# EAGLE design vstupyPCF8574 (EAGLE 9.1.3)
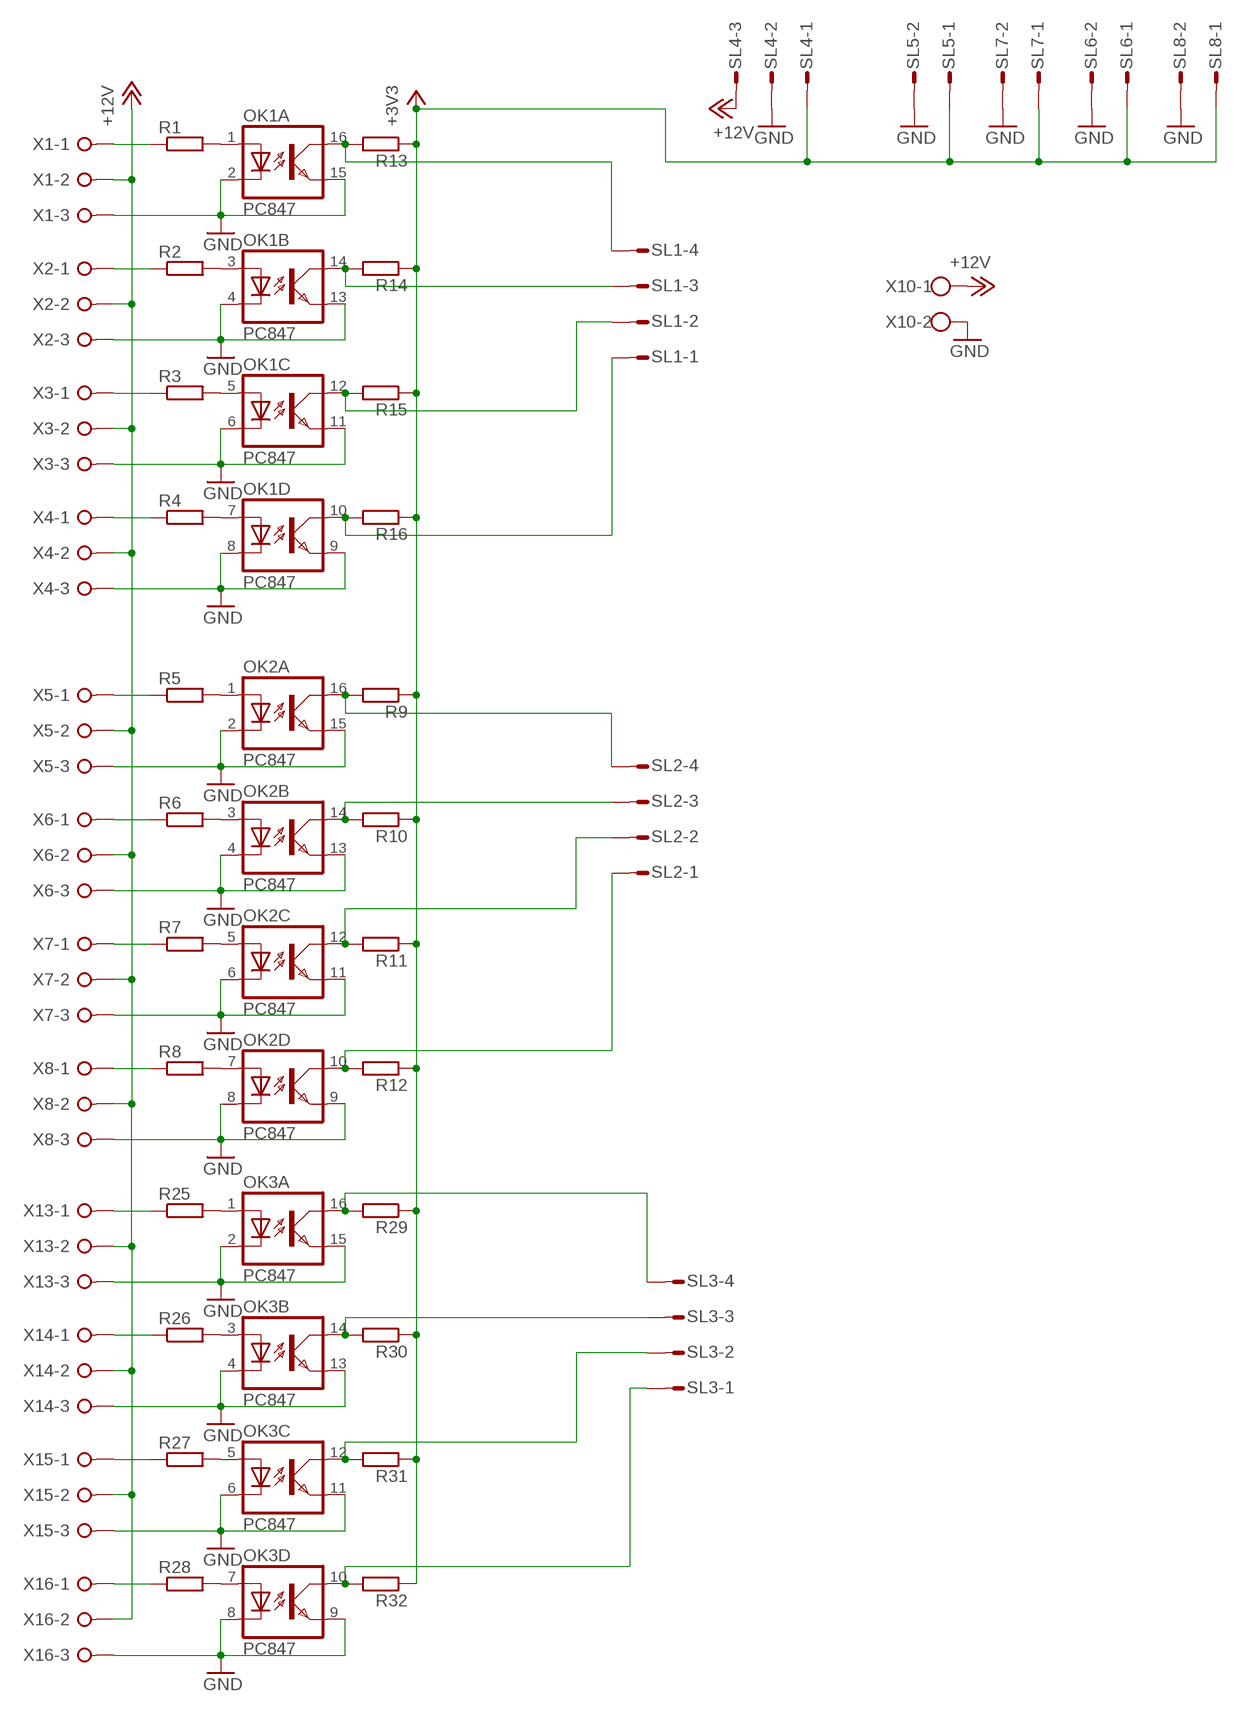
[diagram p0: schematic, sheet 1]

## Parts
OK1  PC847  [DIL16]
OK2  PC847  [DIL16]
OK3  PC847  [DIL16]
R1  R-EU_0204/5  [0204/5]
R2  R-EU_0204/5  [0204/5]
R3  R-EU_0204/5  [0204/5]
R4  R-EU_0204/5  [0204/5]
R5  R-EU_0204/5  [0204/5]
R6  R-EU_0204/5  [0204/5]
R7  R-EU_0204/5  [0204/5]
R8  R-EU_0204/5  [0204/5]
R9  R-EU_0204/5  [0204/5]
R10  R-EU_0204/5  [0204/5]
R11  R-EU_0204/5  [0204/5]
R12  R-EU_0204/5  [0204/5]
R13  R-EU_0204/5  [0204/5]
R14  R-EU_0204/5  [0204/5]
R15  R-EU_0204/5  [0204/5]
R16  R-EU_0204/5  [0204/5]
R25  R-EU_0204/5  [0204/5]
R26  R-EU_0204/5  [0204/5]
R27  R-EU_0204/5  [0204/5]
R28  R-EU_0204/5  [0204/5]
R29  R-EU_0204/5  [0204/5]
R30  R-EU_0204/5  [0204/5]
R31  R-EU_0204/5  [0204/5]
R32  R-EU_0204/5  [0204/5]
SL1  M04S  [04P]
SL2  M04S  [04P]
SL3  M04S  [04P]
SL4  M03S  [03P]
SL5  M02S  [02P]
SL6  M02S  [02P]
SL7  M02S  [02P]
SL8  M02S  [02P]
X1  W237-3E  [W237-3E]
X2  W237-3E  [W237-3E]
X3  W237-3E  [W237-3E]
X4  W237-3E  [W237-3E]
X5  W237-3E  [W237-3E]
X6  W237-3E  [W237-3E]
X7  W237-3E  [W237-3E]
X8  W237-3E  [W237-3E]
X10  W237-102  [W237-102]
X13  W237-3E  [W237-3E]
X14  W237-3E  [W237-3E]
X15  W237-3E  [W237-3E]
X16  W237-3E  [W237-3E]

## Nets
+3V3: R9.1 R10.1 R11.1 R12.1 R13.1 R14.1 R15.1 R16.1 R29.1 R30.1 R31.1 R32.1 SL4.1 SL5.1 SL6.1 SL7.1 SL8.1
+12V: SL4.3 X1.2 X2.2 X3.2 X4.2 X5.2 X6.2 X7.2 X8.2 X10.1 X13.2 X14.2 X15.2 X16.2
GND: OK1.2(A:C) OK1.4(B:C) OK1.6(C:C) OK1.8(D:C) OK1.9(D:EMIT) OK1.11(C:EMIT) OK1.13(B:EMIT) OK1.15(A:EMIT) OK2.2(A:C) OK2.4(B:C) OK2.6(C:C) OK2.8(D:C) OK2.9(D:EMIT) OK2.11(C:EMIT) OK2.13(B:EMIT) OK2.15(A:EMIT) OK3.2(A:C) OK3.4(B:C) OK3.6(C:C) OK3.8(D:C) OK3.9(D:EMIT) OK3.11(C:EMIT) OK3.13(B:EMIT) OK3.15(A:EMIT) SL4.2 SL5.2 SL6.2 SL7.2 SL8.2 X1.3 X2.3 X3.3 X4.3 X5.3 X6.3 X7.3 X8.3 X10.2 X13.3 X14.3 X15.3 X16.3
N$1: OK1.1(A:A) R1.2
N$2: OK1.3(B:A) R2.2
N$3: OK1.5(C:A) R3.2
N$4: OK1.7(D:A) R4.2
N$5: OK2.1(A:A) R5.2
N$6: OK2.3(B:A) R6.2
N$7: OK2.5(C:A) R7.2
N$8: OK2.7(D:A) R8.2
N$9: R5.1 X5.1
N$10: R6.1 X6.1
N$11: R7.1 X7.1
N$12: R8.1 X8.1
N$13: R1.1 X1.1
N$14: R2.1 X2.1
N$15: R3.1 X3.1
N$16: R4.1 X4.1
N$17: OK2.16(A:COL) R9.2 SL2.4
N$18: OK2.14(B:COL) R10.2 SL2.3
N$19: OK2.12(C:COL) R11.2 SL2.2
N$20: OK2.10(D:COL) R12.2 SL2.1
N$21: OK1.16(A:COL) R13.2 SL1.4
N$22: OK1.14(B:COL) R14.2 SL1.3
N$23: OK1.12(C:COL) R15.2 SL1.2
N$24: OK3.16(A:COL) R29.2 SL3.4
N$25: OK3.14(B:COL) R30.2 SL3.3
N$26: OK3.12(C:COL) R31.2 SL3.2
N$27: OK3.10(D:COL) R32.2 SL3.1
N$35: OK1.10(D:COL) R16.2 SL1.1
N$37: OK3.1(A:A) R25.2
N$38: OK3.3(B:A) R26.2
N$39: OK3.5(C:A) R27.2
N$40: OK3.7(D:A) R28.2
N$41: R25.1 X13.1
N$42: R26.1 X14.1
N$43: R27.1 X15.1
N$44: R28.1 X16.1

## Library data of the parts
OK1-OK3 = optocoupler:PC847: SHARP OPTO COUPLER; OC_FARNELL: 9707735; OC_NEWARK: unknown
R1-R16 R25-R32 = resistor:R-EU_: RESISTOR, European symbol
SL1-SL3 = con-amp-quick:M04S: AMP QUICK CONNECTOR; OC_FARNELL: unknown; OC_NEWARK: unknown
SL4 = con-amp-quick:M03S: AMP QUICK CONNECTOR; OC_FARNELL: unknown; OC_NEWARK: unknown
SL5-SL8 = con-amp-quick:M02S: AMP QUICK CONNECTOR; OC_FARNELL: unknown; OC_NEWARK: unknown
X1-X8 X13-X16 = con-wago-508:W237-3E: WAGO SREW CLAMP; OC_FARNELL: unknown; OC_NEWARK: unknown
X10 = con-wago-500:W237-102: WAGO SCREW CLAMP; MPN: 237-102; OC_FARNELL: unknown; OC_NEWARK: 70K9898

## Board
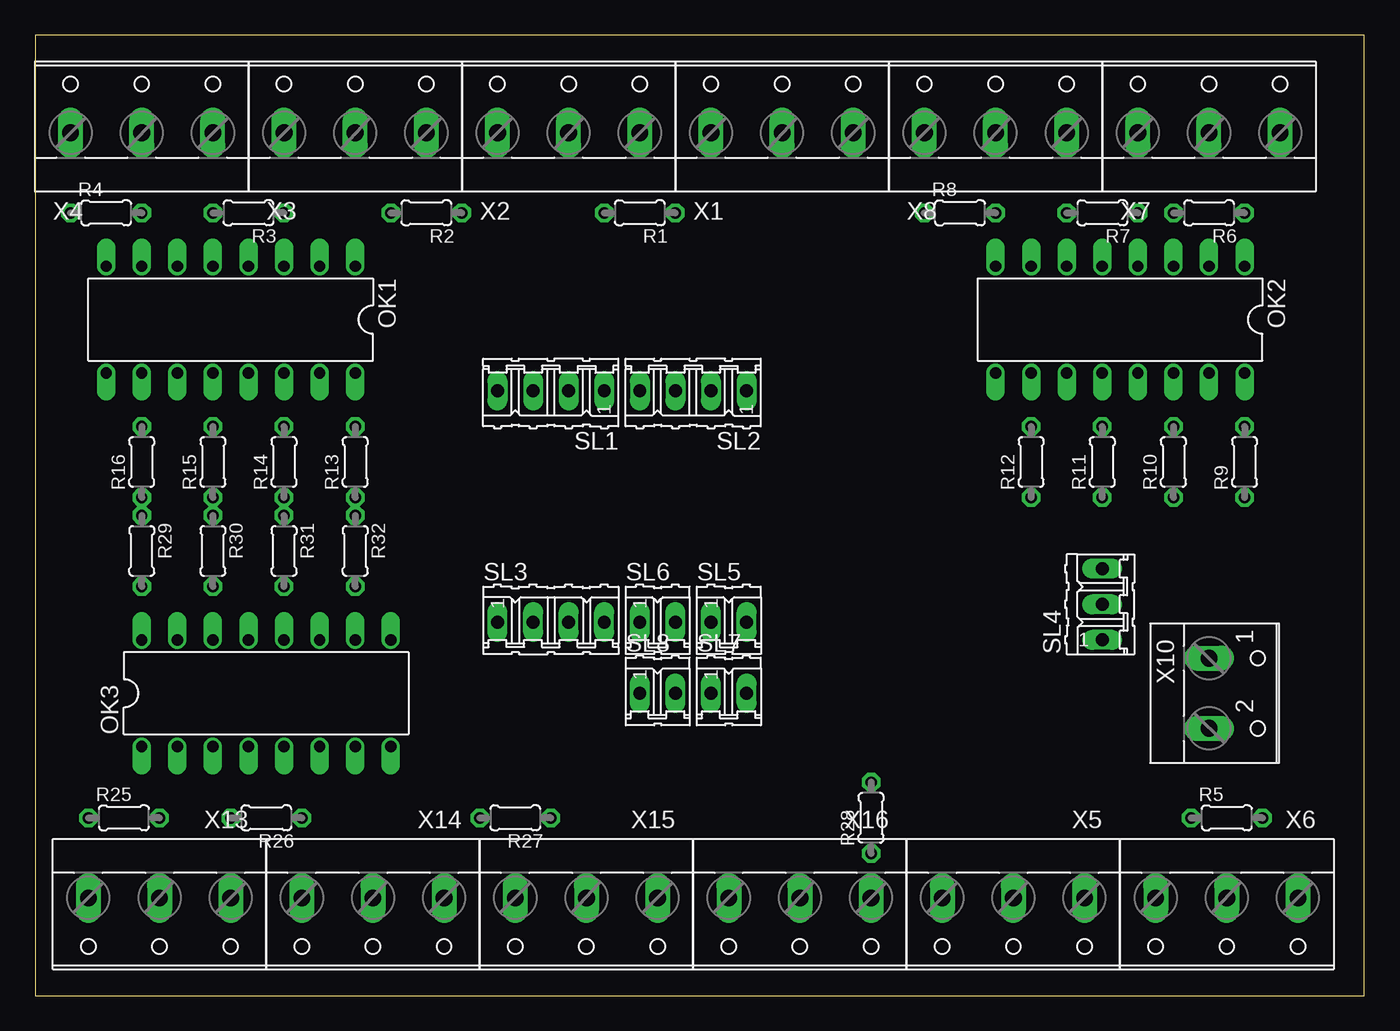
[diagram p1: board, top side]
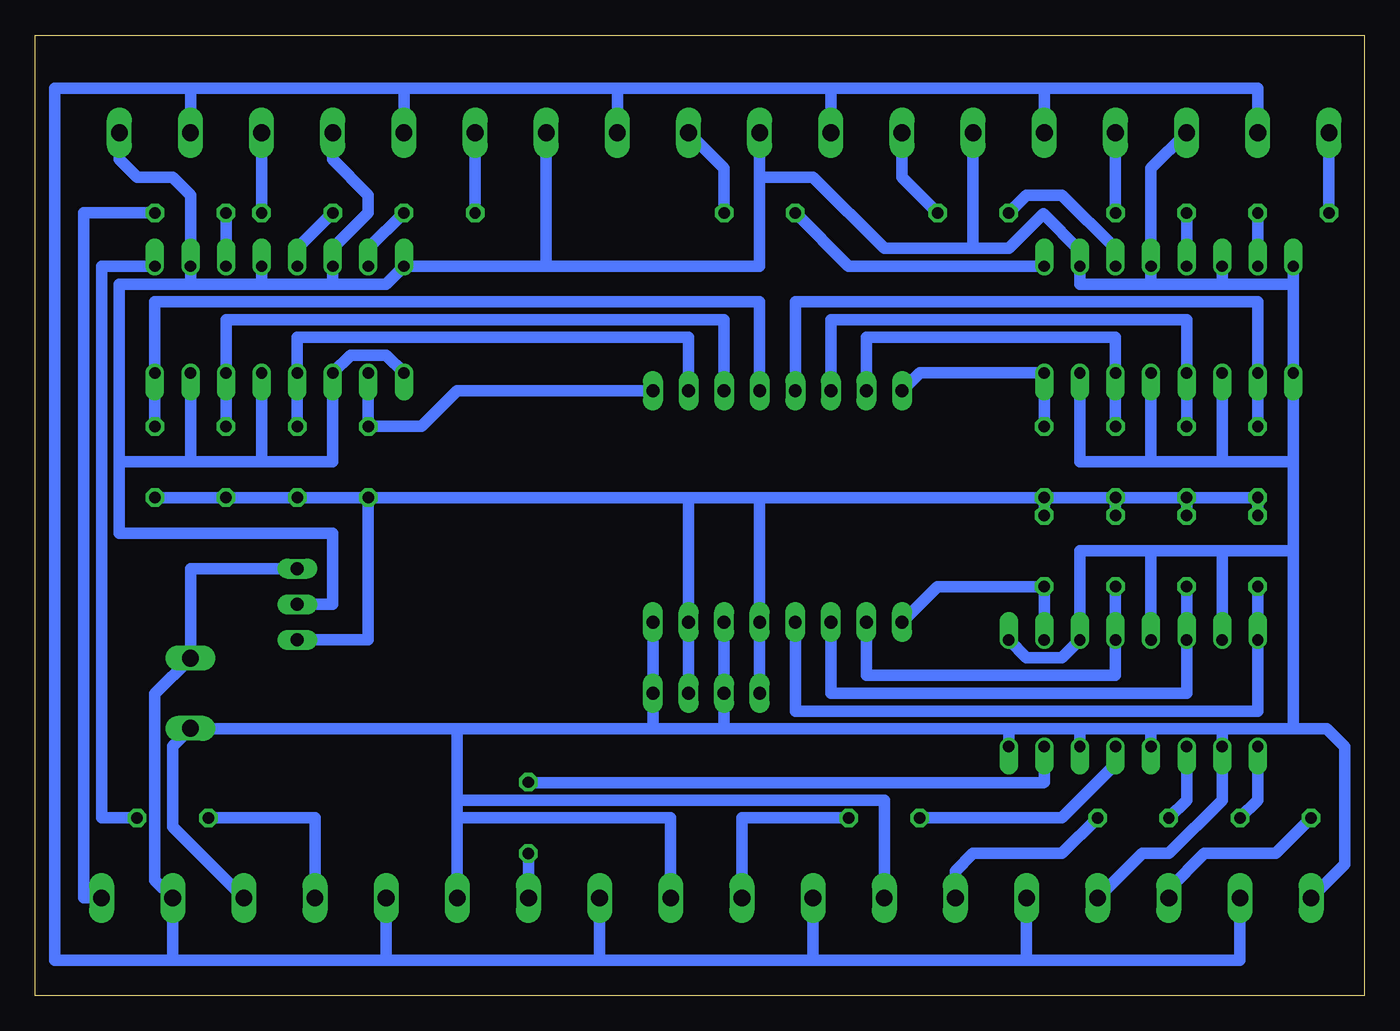
[diagram p2: board, bottom side, seen from below]

Size 94.92 x 68.57 mm. Coordinates in mm from the lower left corner, seen from the top.
Outline: 0,0 94.92,0 94.92,68.57 0,68.57 0,0
Copper layers (1*16): Top 0.035mm / dielectric 1.5mm / Bottom 0.035mm
Design rules "default": minimum track width 10mil, minimum drill 24mil, track to track 8mil, track to pad 8mil, pad to pad 8mil, via to via 8mil, smd to smd 8mil, copper to edge 40mil, drill to drill 8mil, minimum pad ring 10mil, minimum via ring 8mil, stop-mask expansion 4mil, vias tented up to drill 0mil, thermal gap 10mil

### Footprints (pad centres in the part's own frame; a part is rotated, then mirrored left to right if it is on the bottom)
DIL16 = drill 0.813 offset: 1 -8.89,-3.81; 2 -6.35,-3.81; 3 -3.81,-3.81; 4 -1.27,-3.81; 5 1.27,-3.81; 6 3.81,-3.81; 7 6.35,-3.81; 8 8.89,-3.81; 9 8.89,3.81; 10 6.35,3.81; 11 3.81,3.81; 12 1.27,3.81; 13 -1.27,3.81; 14 -3.81,3.81; 15 -6.35,3.81; 16 -8.89,3.81
0204/5 = drill 0.813 octagon: 1 -2.54,0; 2 2.54,0
04P = drill 0.914 long: 1 -3.81,0; 2 -1.27,0; 3 1.27,0; 4 3.81,0
03P = drill 0.914 long: 1 -2.54,0; 2 0,0; 3 2.54,0
02P = drill 0.914 long: 1 -1.27,0; 2 1.27,0
W237-3E = drill 1.194 long: 1 -5.08,-0.635; 2 0,-0.635; 3 5.08,-0.635
W237-102 = drill 1.194 long: 1 -2.5,-1.27; 2 2.5,-1.27

### Placement (x,y rotation side)
OK1  13.97,48.26 180 top
OK2  77.47,48.26 180 top
OK3  16.51,21.59 0 top
R1  43.18,55.88 180 top
R2  27.94,55.88 180 top
R3  15.24,55.88 180 top
R4  5.08,55.88 0 top
R5  85.09,12.7 0 top
R6  83.82,55.88 180 top
R7  76.2,55.88 180 top
R8  66.04,55.88 0 top
R9  86.36,38.1 90 top
R10  81.28,38.1 90 top
R11  76.2,38.1 90 top
R12  71.12,38.1 90 top
R13  22.86,38.1 90 top
R14  17.78,38.1 90 top
R15  12.7,38.1 90 top
R16  7.62,38.1 90 top
R25  6.35,12.7 0 top
R26  16.51,12.7 180 top
R27  34.29,12.7 180 top
R28  59.69,12.7 90 top
R29  7.62,31.75 270 top
R30  12.7,31.75 270 top
R31  17.78,31.75 270 top
R32  22.86,31.75 270 top
SL1  36.83,43.18 180 top
SL2  46.99,43.18 180 top
SL3  36.83,26.67 0 top
SL4  76.2,27.94 90 top
SL5  49.53,26.67 0 top
SL6  44.45,26.67 0 top
SL7  49.53,21.59 0 top
SL8  44.45,21.59 0 top
X1  53.34,62.23 0 top
X2  38.1,62.23 0 top
X3  22.86,62.23 0 top
X4  7.62,62.23 0 top
X5  69.85,6.35 180 top
X6  85.09,6.35 180 top
X7  83.82,62.23 0 top
X8  68.58,62.23 0 top
X10  85.09,21.59 270 top
X13  8.89,6.35 180 top
X14  24.13,6.35 180 top
X15  39.37,6.35 180 top
X16  54.61,6.35 180 top

### Tracks (layer width: path | path; a pad name or v marks a point on that pad's centre or on a via)
+3V3
  Bottom 0.813: R15.1 R16.1 R29.1 | R15.1 R14.1 | R14.1 R13.1 | R30.1 R15.1 | R31.1 R14.1 | R32.1 R13.1 | R12.1 R11.1 R10.1 R9.1 | 48.26,35.56 R12.1 | SL4.1 71.12,25.4 R12.1 | R13.1 43.18,35.56 | 43.18,35.56 48.26,35.56 | 48.26,35.56 SL5.1 SL7.1 | 43.18,35.56 SL6.1 SL8.1
+12V
  Bottom 0.813: X4.2 7.62,64.77 22.86,64.77 | X3.2 22.86,64.77 | X2.2 38.1,64.77 | 38.1,64.77 22.86,64.77 | X1.2 53.34,64.77 | 53.34,64.77 38.1,64.77 | X8.2 68.58,64.77 | 68.58,64.77 53.34,64.77 | 83.82,64.77 68.58,64.77 | X13.2 8.89,2.54 24.13,2.54 | 24.13,2.54 X14.2 | 24.13,2.54 39.37,2.54 | 39.37,2.54 X15.2 | 39.37,2.54 54.61,2.54 | 54.61,2.54 X16.2 | 69.85,2.54 X5.2 | 54.61,2.54 69.85,2.54 | 85.09,2.54 69.85,2.54 | X7.2 83.82,64.77 | 85.09,2.54 X6.2 86.36,8.26 86.36,21.55 X10.1 83.82,30.48 SL4.3 | 85.09,2.54 93.5,2.54 93.5,64.77 83.82,64.77
GND
  Bottom 0.813: 5.08,50.8 OK1.9 5.08,38.1 | 5.08,50.8 OK1.8 | X4.3 15.24,59.05 OK1.4 15.24,50.8 | 27.94,53.34 X3.3 | 27.94,53.34 34.29,53.34 39.37,58.42 43.18,58.42 X2.3 43.18,52.07 58.42,52.07 | 58.42,52.07 X1.3 | 58.42,52.07 OK2.8 69.85,50.8 73.66,50.8 | X8.3 73.66,59.69 71.12,57.15 71.12,55.88 73.66,53.34 OK2.6 73.66,50.8 | X7.3 88.9,59.69 87.63,58.42 85.09,58.42 83.82,57.15 OK2.2 83.82,50.8 | 27.94,53.34 25.4,53.34 22.94,55.8 20.32,53.17 OK1.2 20.32,50.8 15.24,50.8 | 5.08,50.8 10.16,50.8 | OK1.6 10.16,50.8 | 10.16,50.8 15.24,50.8 | 73.66,50.8 78.74,50.8 | 78.74,50.8 83.82,50.8 | OK2.4 78.74,50.8 | 10.16,19.05 OK3.2 10.16,13.97 13.97,10.16 15.88,10.16 X14.3 | 10.16,19.05 15.24,19.05 | 15.24,19.05 20.32,19.05 | 20.32,19.05 25.4,19.05 | 25.4,19.05 OK3.8 | OK3.4 15.24,19.05 | OK3.6 20.32,19.05 | X13.3 1.42,9.37 1.42,17.78 2.69,19.05 5.08,19.05 | 5.08,19.05 10.16,19.05 | X5.3 64.77,12.7 | 64.77,12.7 64.77,13.97 | 64.77,13.97 64.77,19.05 | 5.08,38.1 10.16,38.1 | 10.16,38.1 OK1.11 | 10.16,38.1 15.24,38.1 | 15.24,38.1 OK1.13 | 15.24,38.1 20.32,38.1 OK1.15 | OK3.13 15.24,31.75 | 15.24,31.75 20.32,31.75 OK3.11 21.59,24.13 24.13,24.13 OK3.9 | OK3.15 10.16,31.75 | 10.16,31.75 15.24,31.75 | OK2.15 83.82,38.1 | 83.82,38.1 78.74,38.1 | 78.74,38.1 OK2.13 | 78.74,38.1 73.66,38.1 OK2.11 72.39,45.72 69.85,45.72 OK2.9 | 83.82,38.1 88.9,38.1 | 5.08,38.1 5.08,31.75 | 5.08,31.75 10.16,31.75 | 5.08,31.75 5.08,19.05 | X16.3 49.53,12.7 64.77,12.7 | 50.8,19.05 64.77,19.05 | X15.3 34.29,13.97 64.77,13.97 | 83.82,50.8 88.9,50.8 88.9,38.1 | 64.77,19.05 82.47,19.05 82.51,19.09 X10.2 85.09,17.82 85.09,12.06 X6.3 | 25.4,19.05 45.72,19.05 | 45.72,19.05 50.8,19.05 | SL4.2 73.66,27.94 73.66,33.02 88.9,33.02 88.9,38.1
  Bottom 0.813: SL5.2 SL7.2 50.8,19.05 | SL6.2 SL8.2 45.72,19.05
N$1
  Bottom 0.813: R1.2 36.83,52.07 OK1.1
N$2
  Bottom 0.813: OK1.3 17.78,53.34 21.59,57.15 24.13,57.15 R2.2
N$3
  Bottom 0.813: R3.2 OK1.5
N$4
  Bottom 0.813: R4.2 OK1.7
N$5
  Bottom 0.813: R5.2 90.17,12.7 90.17,52.07 OK2.1
N$6
  Bottom 0.813: R6.2 OK2.3
N$7
  Bottom 0.813: R7.2 76.2,53.34 OK2.5
N$8
  Bottom 0.813: R8.2 71.12,53.34 OK2.7
N$9
  Bottom 0.813: X5.1 74.93,12.7 R5.1
N$10
  Bottom 0.813: R6.1 91.44,55.88 91.44,6.99 X6.1
N$11
  Bottom 0.813: X7.1 R7.1
N$12
  Bottom 0.813: X8.1 R8.1
N$13
  Bottom 0.813: R1.1 45.72,59.05 X1.1
N$14
  Bottom 0.813: X2.1 33.02,60.32 33.02,58.42 R2.1
N$15
  Bottom 0.813: X3.1 R3.1
N$16
  Bottom 0.813: X4.1 R4.1
N$17
  Bottom 0.813: R9.2 OK2.16 86.36,49.53 43.18,49.53 SL2.4
N$18
  Bottom 0.813: R10.2 OK2.14 81.28,48.26 45.72,48.26 SL2.3
N$19
  Bottom 0.813: R11.2 OK2.12 76.2,46.99 48.26,46.99 SL2.2
N$20
  Bottom 0.813: OK2.10 R12.2 67.31,40.64 64.77,43.18 SL2.1
N$21
  Bottom 0.813: R13.2 OK1.16 31.75,44.45 SL1.4
N$22
  Bottom 0.813: R14.2 OK1.14 17.78,46.99 35.56,46.99 SL1.3
N$23
  Bottom 0.813: R15.2 OK1.12 12.7,48.26 38.1,48.26 SL1.2
N$24
  Bottom 0.813: R29.2 OK3.16 7.62,20.32 40.64,20.32 SL3.4
N$25
  Bottom 0.813: R30.2 OK3.14 12.7,21.59 38.1,21.59 SL3.3
N$26
  Bottom 0.813: R31.2 OK3.12 17.78,22.86 35.56,22.86 SL3.2
N$27
  Bottom 0.813: OK3.10 R32.2 30.48,29.21 SL3.1
N$35
  Bottom 0.813: R16.2 OK1.10 7.62,49.53 40.64,49.53 SL1.1
N$37
  Bottom 0.813: OK3.1 7.62,13.97 R25.2
N$38
  Bottom 0.813: OK3.3 12.7,13.97 R26.2
N$39
  Bottom 0.813: OK3.5 17.78,16.51 21.59,12.7 R27.2
N$40
  Bottom 0.813: OK3.7 22.86,15.24 22.91,15.19 59.64,15.19 R28.2
N$41
  Bottom 0.813: R25.1 6.35,10.16 11.43,10.16 13.97,7.62 X13.1
N$42
  Bottom 0.813: R26.1 21.59,10.16 27.94,10.16 29.21,8.89 X14.1
N$43
  Bottom 0.813: X15.1 44.45,12.7 R27.1
N$44
  Bottom 0.813: R28.1 X16.1